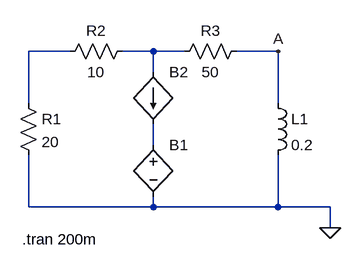
[diagram p0: schematic shoot.asc]
shoot.asc, the LTspice schematic file:
Version 4
SHEET 1 880 680
WIRE 144 64 80 64
WIRE 272 64 224 64
WIRE 320 64 272 64
WIRE 464 64 400 64
WIRE 272 96 272 64
WIRE 80 144 80 64
WIRE 464 144 464 64
WIRE 272 208 272 176
WIRE 80 304 80 224
WIRE 272 304 272 288
WIRE 272 304 80 304
WIRE 464 304 464 224
WIRE 464 304 272 304
WIRE 544 304 464 304
WIRE 544 336 544 304
FLAG 544 336 0
FLAG 464 64 A
SYMBOL res 64 128 R0
SYMATTR InstName R1
SYMATTR Value 20
SYMBOL res 240 48 R90
WINDOW 0 0 56 VBottom 2
WINDOW 3 32 56 VTop 2
SYMATTR InstName R2
SYMATTR Value 10
SYMBOL res 416 48 R90
WINDOW 0 0 56 VBottom 2
WINDOW 3 32 56 VTop 2
SYMATTR InstName R3
SYMATTR Value 50
SYMBOL ind 448 128 R0
SYMATTR InstName L1
SYMATTR Value 0.2
SYMATTR SpiceLine Rser=0.001p
SYMBOL bv 272 192 R0
WINDOW 3 24 96 Invisible 2
SYMATTR InstName B1
SYMATTR Value V={if(time>100m,0,100)}
SYMBOL bi 272 96 R0
WINDOW 3 24 80 Invisible 2
SYMATTR InstName B2
SYMATTR Value R=if(time>100m,1000t,0.001f)
TEXT 70 354 Left 2 !.tran 200m

The netlist it stands for:
* shoot.asc
R1 N001 0 20
R2 N002 N001 10
R3 A N002 50
L1 A 0 0.2 Rser=0.001p
B1 N003 0 V={if(time>100m,0,100)}
B2 N002 N003 R=if(time>100m,1000t,0.001f)
.tran 200m
.backanno
.end